# Altium schematic sheet FINGER_MCU.SchDoc
size Letter; SheetNumber: 8; SheetTotal: 15
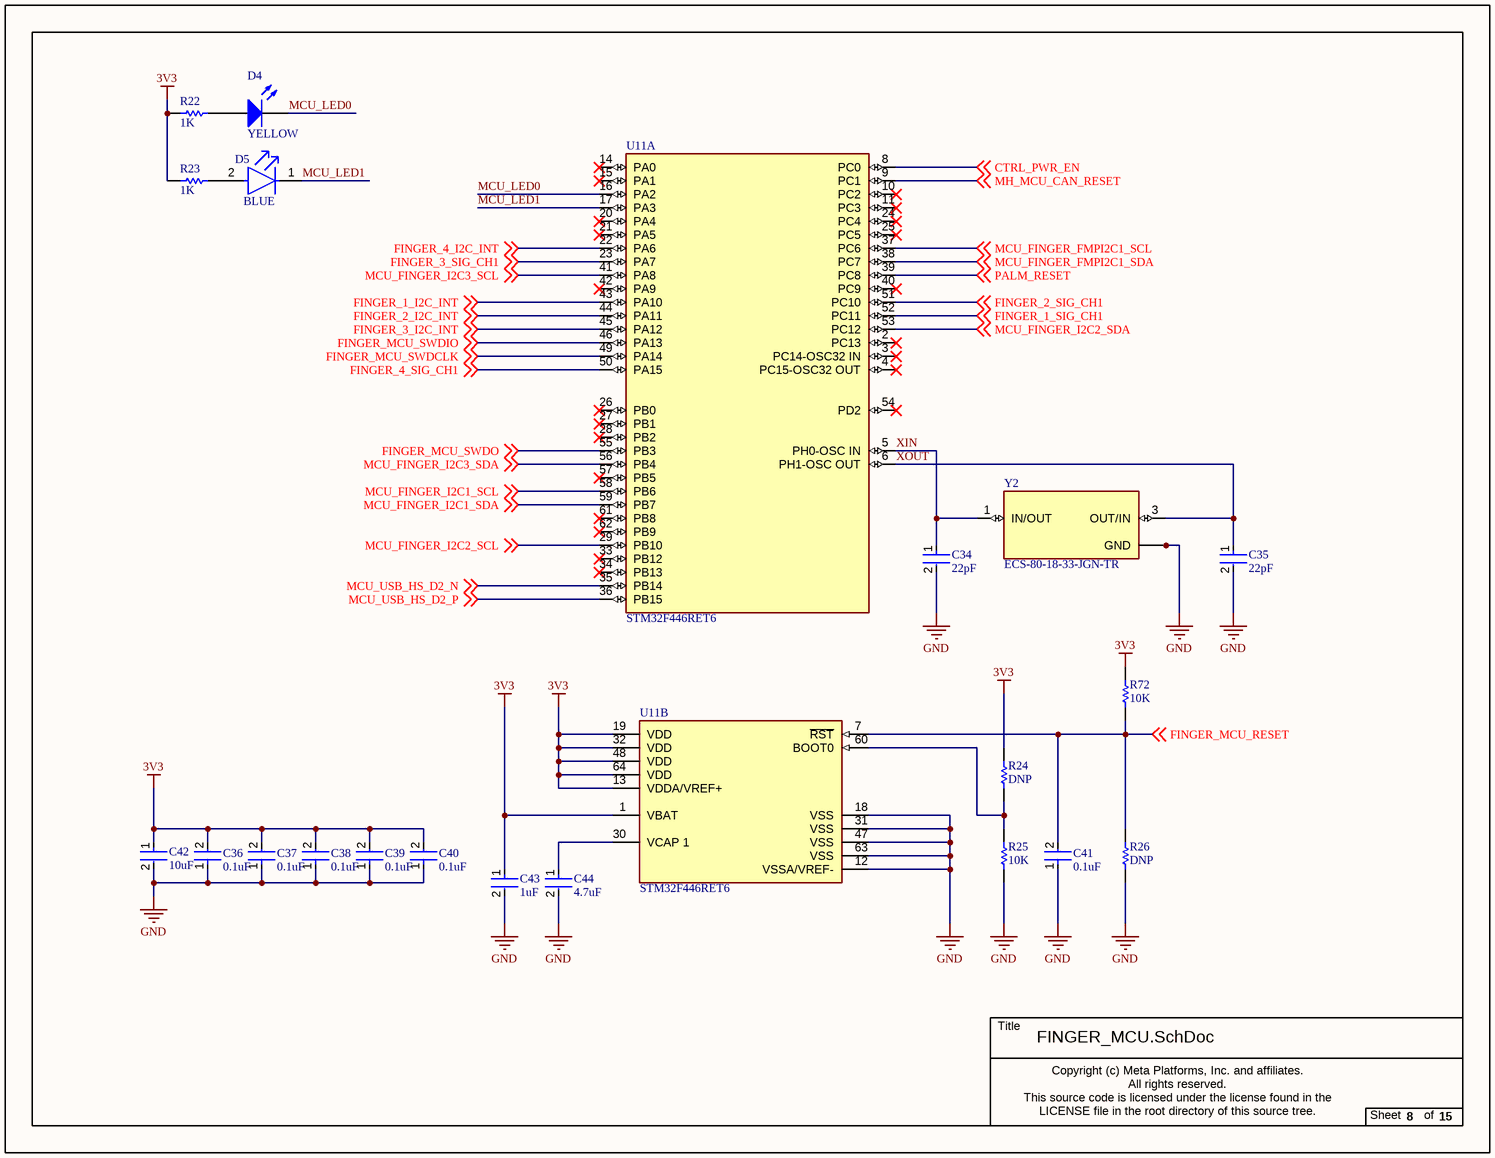
[diagram p0: FINGER_MCU.SchDoc]

## Parts
C34  22pF  [FP-0402-L_1_0_1-W_0_5_0_1-MFG]
C35  22pF  [FP-0402-L_1_0_1-W_0_5_0_1-MFG]
C36  0.1uF  [FP-CC0201-BA-MFG]
C37  0.1uF  [FP-CC0201-BA-MFG]
C38  0.1uF  [FP-CC0201-BA-MFG]
C39  0.1uF  [FP-CC0201-BA-MFG]
C40  0.1uF  [FP-CC0201-BA-MFG]
C41  0.1uF  [FP-CC0201-BA-MFG]
C42  10uF  [FP-CL05A106MP5NUNC-MFG]
C43  1uF  [FP-CL511-IPC_C]
C44  4.7uF  [FP-C1005-050-0_15-MFG]
D4  YELLOW  [0603_A]
D5  BLUE  [FP-LTST-C191TBKT-MFG]
R22  1K  [RESC1005X40X25NL05T05]
R23  1K  [RESC1005X40X25NL05T05]
R24  DNP  [RESC1005X40X25ML05T10]
R25  10K  [RESC1005X40X25ML05T10]
R26  DNP  [RESC1005X40X25NL05T10]
R72  10K  [RESC1005X40X25ML05T10]
U11  STM32F446RET6  [FP-LQFP64-5W-MFG]  (parts A,B of 2)
Y2  ECS-80-18-33-JGN-TR  [XTAL_ECS-240-8-33-AGN-TR]

## Nets
3V3: C36.2 C37.2 C38.2 C39.2 C40.2 C42.1 C43.1 R22.1 R23.1 R24.2 R72.2 U11.1(VBAT) U11.13(VDDA/VREF+) U11.19(VDD) U11.32(VDD) U11.48(VDD) U11.64(VDD)
GND: C34.2 C35.2 C36.1 C37.1 C38.1 C39.1 C40.1 C41.1 C42.2 C43.2 C44.2 R25.1 R26.1 U11.12(VSSA/VREF-) U11.18(VSS) U11.31(VSS) U11.47(VSS) U11.63(VSS) Y2.2(GND) Y2.4(GND)
CTRL_PWR_EN: U11.8(PC0) ; off-sheet CTRL_PWR_EN
FINGER_1_I2C_INT: U11.43(PA10) ; off-sheet FINGER_1_I2C_INT
FINGER_1_SIG_CH1: U11.52(PC11) ; off-sheet FINGER_1_SIG_CH1
FINGER_2_I2C_INT: U11.44(PA11) ; off-sheet FINGER_2_I2C_INT
FINGER_2_SIG_CH1: U11.51(PC10) ; off-sheet FINGER_2_SIG_CH1
FINGER_3_I2C_INT: U11.45(PA12) ; off-sheet FINGER_3_I2C_INT
FINGER_3_SIG_CH1: U11.23(PA7) ; off-sheet FINGER_3_SIG_CH1
FINGER_4_I2C_INT: U11.22(PA6) ; off-sheet FINGER_4_I2C_INT
FINGER_4_SIG_CH1: U11.50(PA15) ; off-sheet FINGER_4_SIG_CH1
FINGER_MCU_RESET: C41.2 R26.2 R72.1 U11.7(~{RST}) ; off-sheet FINGER_MCU_RESET
FINGER_MCU_SWDCLK: U11.49(PA14) ; off-sheet FINGER_MCU_SWDCLK
FINGER_MCU_SWDIO: U11.46(PA13) ; off-sheet FINGER_MCU_SWDIO
FINGER_MCU_SWDO: U11.55(PB3) ; off-sheet FINGER_MCU_SWDO
MCU_FINGER_FMPI2C1_SCL: U11.37(PC6) ; off-sheet MCU_FINGER_FMPI2C1_SCL
MCU_FINGER_FMPI2C1_SDA: U11.38(PC7) ; off-sheet MCU_FINGER_FMPI2C1_SDA
MCU_FINGER_I2C1_SCL: U11.58(PB6) ; off-sheet MCU_FINGER_I2C1_SCL
MCU_FINGER_I2C1_SDA: U11.59(PB7) ; off-sheet MCU_FINGER_I2C1_SDA
MCU_FINGER_I2C2_SCL: U11.29(PB10) ; off-sheet MCU_FINGER_I2C2_SCL
MCU_FINGER_I2C2_SDA: U11.53(PC12) ; off-sheet MCU_FINGER_I2C2_SDA
MCU_FINGER_I2C3_SCL: U11.41(PA8) ; off-sheet MCU_FINGER_I2C3_SCL
MCU_FINGER_I2C3_SDA: U11.56(PB4) ; off-sheet MCU_FINGER_I2C3_SDA
MCU_LED0: D4.1(K) U11.16(PA2)
MCU_LED1: D5.1(C) U11.17(PA3)
MCU_USB_HS_D2_N: U11.35(PB14) ; off-sheet MCU_USB_HS_D2_N
MCU_USB_HS_D2_P: U11.36(PB15) ; off-sheet MCU_USB_HS_D2_P
MH_MCU_CAN_RESET: U11.9(PC1) ; off-sheet MH_MCU_CAN_RESET
PALM_RESET: U11.39(PC8) ; off-sheet PALM_RESET
XIN: C34.1 U11.5(PH0-OSC_IN) Y2.1(IN/OUT)
XOUT: C35.1 U11.6(PH1-OSC_OUT) Y2.3(OUT/IN)
NetC44_1: C44.1 U11.30(VCAP_1)
NetD4_2: D4.2(A) R22.2
NetD5_2: D5.2(A) R23.2
NetR24_1: R24.1 R25.2 U11.60(BOOT0)

Not connected (* = marked no-connect by the designer): U11 2(PC13)* 3(PC14-OSC32_IN)* 4(PC15-OSC32_OUT)* 10(PC2)* 11(PC3)* 14(PA0)* 15(PA1)* 20(PA4)* 21(PA5)* 24(PC4)* 25(PC5)* 26(PB0)* 27(PB1)* 28(PB2)* 33(PB12)* 34(PB13)* 40(PC9)* 42(PA9)* 54(PD2)* 57(PB5)* 61(PB8)* 62(PB9)*

## Notes on the sheet
- Title
- Copyright (c) Meta Platforms, Inc. and affiliates.
  All rights reserved.
  This source code is licensed under the license found in the
  LICENSE file in the root directory of this source tree.
- Sheet
- of

## Library data of the parts
C34 C35 = CMP-2008-02613-2: General Purpose Ceramic Capacitor, 0402, 22pF, 5%, C0G, 30ppm/°C, 50V; Temperature Coefficient: 30ppm/°C; Mount: Surface Mount; Length: 1mm; Construction: Flat; Contact Plating: Tin; REACH SVHC: No SVHC; Case/Package: 0402; Voltage: 50V; Case Code (Imperial): 0402; Thickness: 0.022inch; Radiation Hardening: No; Number of Pins: 2; Tolerance: 5%; Max Operating Temperature: 125°C; RoHS Compliant: Yes; Voltage Rating: 50V; Case Code (Metric): 1005; Package Quantity: 1; Width: 0.02inch; Termination: SMD/SMT; Lead Free: Lead Free; Height: 0.5mm; Voltage Rating (DC): 50V; Capacitance: 22pF; Min Operating Temperature: -55°C; Series: -; Depth: 0.5mm; Dielectric: C0G; Packaging: Tape and Reel
C36-C41 = CMP-03422-000376-1: CAP CER 0.1UF 6.3V X5R 0201; Manufacturer: Yageo; Manufacturer Part Number: CC0201KRX5R5BB104; Tolerance: 0.1; Temperature Coefficient: 15%; Value: 100 nF; Material: Ceramic; Automotive: No; Device Class L2: Capacitors; Temperature Range High: +85°C; Capacitance: 100 nF; Temperature: -55°C to +85°C; ComponentLink2URL: http://www.yageo.com/documents/recent/UPY-GPHC_X5R_4V-to-50V_25.pdf; Category: Cap; Mouser Description: Multilayer Ceramic Capacitors MLCC - SMD/SMT 100nF 6.3V X5R 10%; Ipc Land Pattern Name: CAPC6030X30; Temperature Characteristic: X5R; Voltage Rating: 6.3 V; Lead Free: Yes; Digikey Description: CAP CER 0.1UF 6.3V X5R 0201; Device Class L1: Passive Components; Octopart: https://octopart.com/cc0201krx5r5bb104-yageo-9292636; Height: 0.33mm; Package: CC0201-BA; Footprint Url: http://www.yageo.com/exep/pages/download/literatures/UPY-C_GEN_24.pdf; ComponentLink2Description: Datasheet; Device Class L3: Ceramic Capacitors; Temperature Range Low: -55°C; RoHS: TRUE
C42 = CMP-13271-000002-1: CAP CER 10UF 10V X5R 0402; Manufacturer Part Number: CL05A106MP5NUNC; Manufacturer: Samsung; Temperature Coefficient: 15%; Tolerance: 20%; Material: Ceramic; Octopart: https://octopart.com/cl05a106mp5nunc-samsung-22457395; Voltage Rating: 10V; RoHS: TRUE; Value: 10uF; Height: 0.7mm; Digikey Description: CAP CER 10UF 10V X5R 0402; Automotive: No; Package: CL05A106MP5NUNC; Device Class L1: Passive Components; Capacitance: 10uF; Temperature Range High: +85°C; ComponentLink2Description: Datasheet; Device Class L2: Capacitors; Temperature Characteristic: X5R; Temperature: -55°C to +85°C; ComponentLink2URL: http://www.samsungsem.com/kr/support/product-search/mlcc/__icsFiles/afieldfile/2019/05/10/19-CL05A106MP5NUNC.pdf; Device Class L3: Ceramic Capacitors; Category: Cap; Temperature Range Low: -55°C; Ipc Land Pattern Name: CAPC10050X50; Lead Free: Yes
C43 = CMP-13271-001936-1: Cap Ceramic 1uF 10V X5R ±10% SMD 0402 +85°C Paper T/R; Depth: 0.5mm; Case Code (Imperial): 0402; Material: Ceramic; Mount: Surface Mount; Thickness: 0.022inch; Dielectric: X5R; Capacitance: 1uF; Radiation Hardening: No; Case/Package: 0402; Length: 1mm; Tolerance: 10%; Max Operating Temperature: 85°C; Package Quantity: 1; Width: 0.02inch; Voltage Rating: 10V; Contact Plating: Tin; Height: 0.5mm; Min Operating Temperature: -55°C; Case Code (Metric): 1005; Packaging: Tape and Reel
C44 = CMP-2000-05997-2: CAP CER 4.7UF 10V X5R 0402; Dielectric Material: Ceramic; Tolerance: 10%; Series: C; Package Quantity: 10000; Max Operating Temperature: 85°C; Case Code (Imperial): 0402; Lead Free: Lead Free; Voltage Rating (DC): 10V; Packaging: Cut Tape; Voltage Rating: 10V; Min Operating Temperature: -55°C; Dielectric: X5R; Thickness: 0.022inch; Width: 0.02inch; Case/Package: 0402; Case Code (Metric): 1005; Capacitance: 4.7uF; Length: 0.039inch; RoHS Compliant: Yes; REACH SVHC: No SVHC; Mount: Surface Mount
D4 = CMP-1426-00005-1: SMD mono-color Chip LED, WL-SMCW, Yellow; PartNumber: 150060YS75000; Manufacturer: Wuerth Elektronik; ComponentLink1URL: http://www.we-online.com; Color: Yellow; ComponentLink2Description: Datasheet; ComponentLink2URL: http://katalog.we-online.com/led/datasheet/150060YS75000.pdf; ComponentLink1Description: Manufacturer URL; PackageReference: 0603_A
D5 = CMP-22017-000008-1: LED BLUE CLEAR CHIP SMD; Lens Color: Colorless; Dominant Wavelength: 475nm; Forward Current: 20mA; Wavelength: 468nm; Viewing Angle: 130°; Power Dissipation: 76mW; Luminous Intensity: 180mcd; Reverse Voltage: 5V; Number of Elements: 1; Lens Style: Diffused; Forward Voltage: 3.8V; Max Power Dissipation: 75mW; Case Code (Metric): 1608; Packaging: Tape and Reel; Case/Package: 0603; Depth: 1.6mm; Mount: Surface Mount; Lead Free: Lead Free; Min Operating Temperature: -20°C; Lens Transparency: Clear; Illumination Color: Blue; Height: 0.55mm; Test Current: 20mA; Case Code (Imperial): 0603; Max Operating Temperature: 80°C; Number of Pins: 2; Length: 0.8mm; Radiation Hardening: No; Package Quantity: 1; Number of LEDs: 1; Width: 0.8mm; Color: Blue
R22 R23 = CMP-1011-00510-4: Chip Resistor, 1 KOhm, +/- 1%, 100 mW, -55 to 155 degC, 0402 (1005 Metric), RoHS, Tape and Reel; PartNumber: ERJ-2RKF1001X; Manufacturer: Basic Passives; Voltage Rating: 50 V; Case\/Package: 0402; Resistance: 1 KOhm; Power Rating: 100 mW; DatasheetVersion: 04/2015; Radiation Hardening: No; Pins: 2; Height: 0.35 mm; RoHSCompliant: true; Case Code (Imperial): 0402; ComponentLink2Description: Datasheet; ComponentLink1Description: Manufacturer URL; PackageReference: 0402; Mount: Surface Mount; Package Quantity: 10000; Tolerance: 1%; ComponentLink1URL: http://www.panasonic.com/; PackageDescription: 2-Pin Surface Mount Device, Body 1 x 0.5 mm; Mounting Technology: Surface Mount; Case Code (Metric): 1005; ComponentLink2URL: http://industrial.panasonic.com/cdbs/www-data/pdf/RDA0000/AOA0000C86.pdf; REACH SVHC: Yes; Packaging: Tape and Reel; Max Operating Temperature: 155 degC; Min Operating Temperature: -55 degC; Width: 0.5 mm; Length: 1 mm
R24 R25 R72 = CMP-2002-03043-1: Part Number: CRCW040210K0FKEDHP; Manufacturer: Vishay Dale
R26 = CMP-1011-00001-2: Manufacturer: Yageo / Phycomp; Part Number: RC0402JR-070RL
U11 = CMP-12105-000007-1: IC MCU 32BIT 512KB FLASH 64LQFP; Manufacturer: ST; Number Of Spi Channels: 4; Ram Size: 128KBytes; Standoff Height: 0.05mm; Number Of Uart Channels: 6; Number Of Pwm Channels: 32; Max Junction Temp: +105°C; Number Of I/Os: 50; Number Of Usb Channels: 2; Frequency: 180MHz; Number Of A/D Converters: 3; Max Supply Voltage: 3.6V; Number Of Adc Channels: 16; Interface: I2C,SPI,UART,USART,CAN,USB,LIN,IrDA,I2S,Other; Memory Size: 512KBytes; Number Of Timers/Counters: 14; Min Supply Voltage: 1.7V; Core Architecture: ARM Cortex-M4; Data Bus Width: 32bits; Number Of Cores: 1; Ambient Temperature Range Low: -40°C; ComponentLink2URL: https://www.st.com/en/microcontrollers-microprocessors/stm32f446re.html; Category: IC; Height: 1.6mm; Ipc Land Pattern Name: QFP50P1200X1200X160-64; Manufacturer Part Number: STM32F446RET6; Octopart: https://octopart.com/stm32f446ret6-stmicroelectronics-52642920; Temperature Range High: +105°C; Lead Free: Yes; Mouser Description: ARM Microcontrollers - MCU High-performance and DSP with FP, ARM Cortex-M4 MCU with 512 Kbytes Flash, 180 MHz CPU, Art Accelerator, SDRAM; Digikey Description: IC MCU 32BIT 512KB FLASH 64LQFP; Ambient Temperature Range High: +85°C; Number Of I2C Channels: 4; Memory Type: FLASH; RoHS: TRUE; Automotive: No; Device Class L1: Integrated Circuits (ICs); Temperature: -40°C to +105°C; Device Class L2: Embedded Processors and Controllers; Device Class L3: Microcontrollers; Temperature Range Low: -40°C; Package: LQFP64-5W; ComponentLink2Description: Datasheet
Y2 = ECS-80-18-33-JGN-TR: The sub miniature ECX-32 is a compact SMD Crystal. The 3.2 x 2.5 x 0.8 mm ceramic package is ideal for todayâ€™s SMD manufacturing environment.; MF: {'manufacturer': u'ECS Inc.'}; Price: None; Value: *; Package: None; Availability: Unavailable; MP: ECS-80-18-33-JGN-TR